# EAGLE design AugmentedStethoscope_v2c (EAGLE 8.7.0)
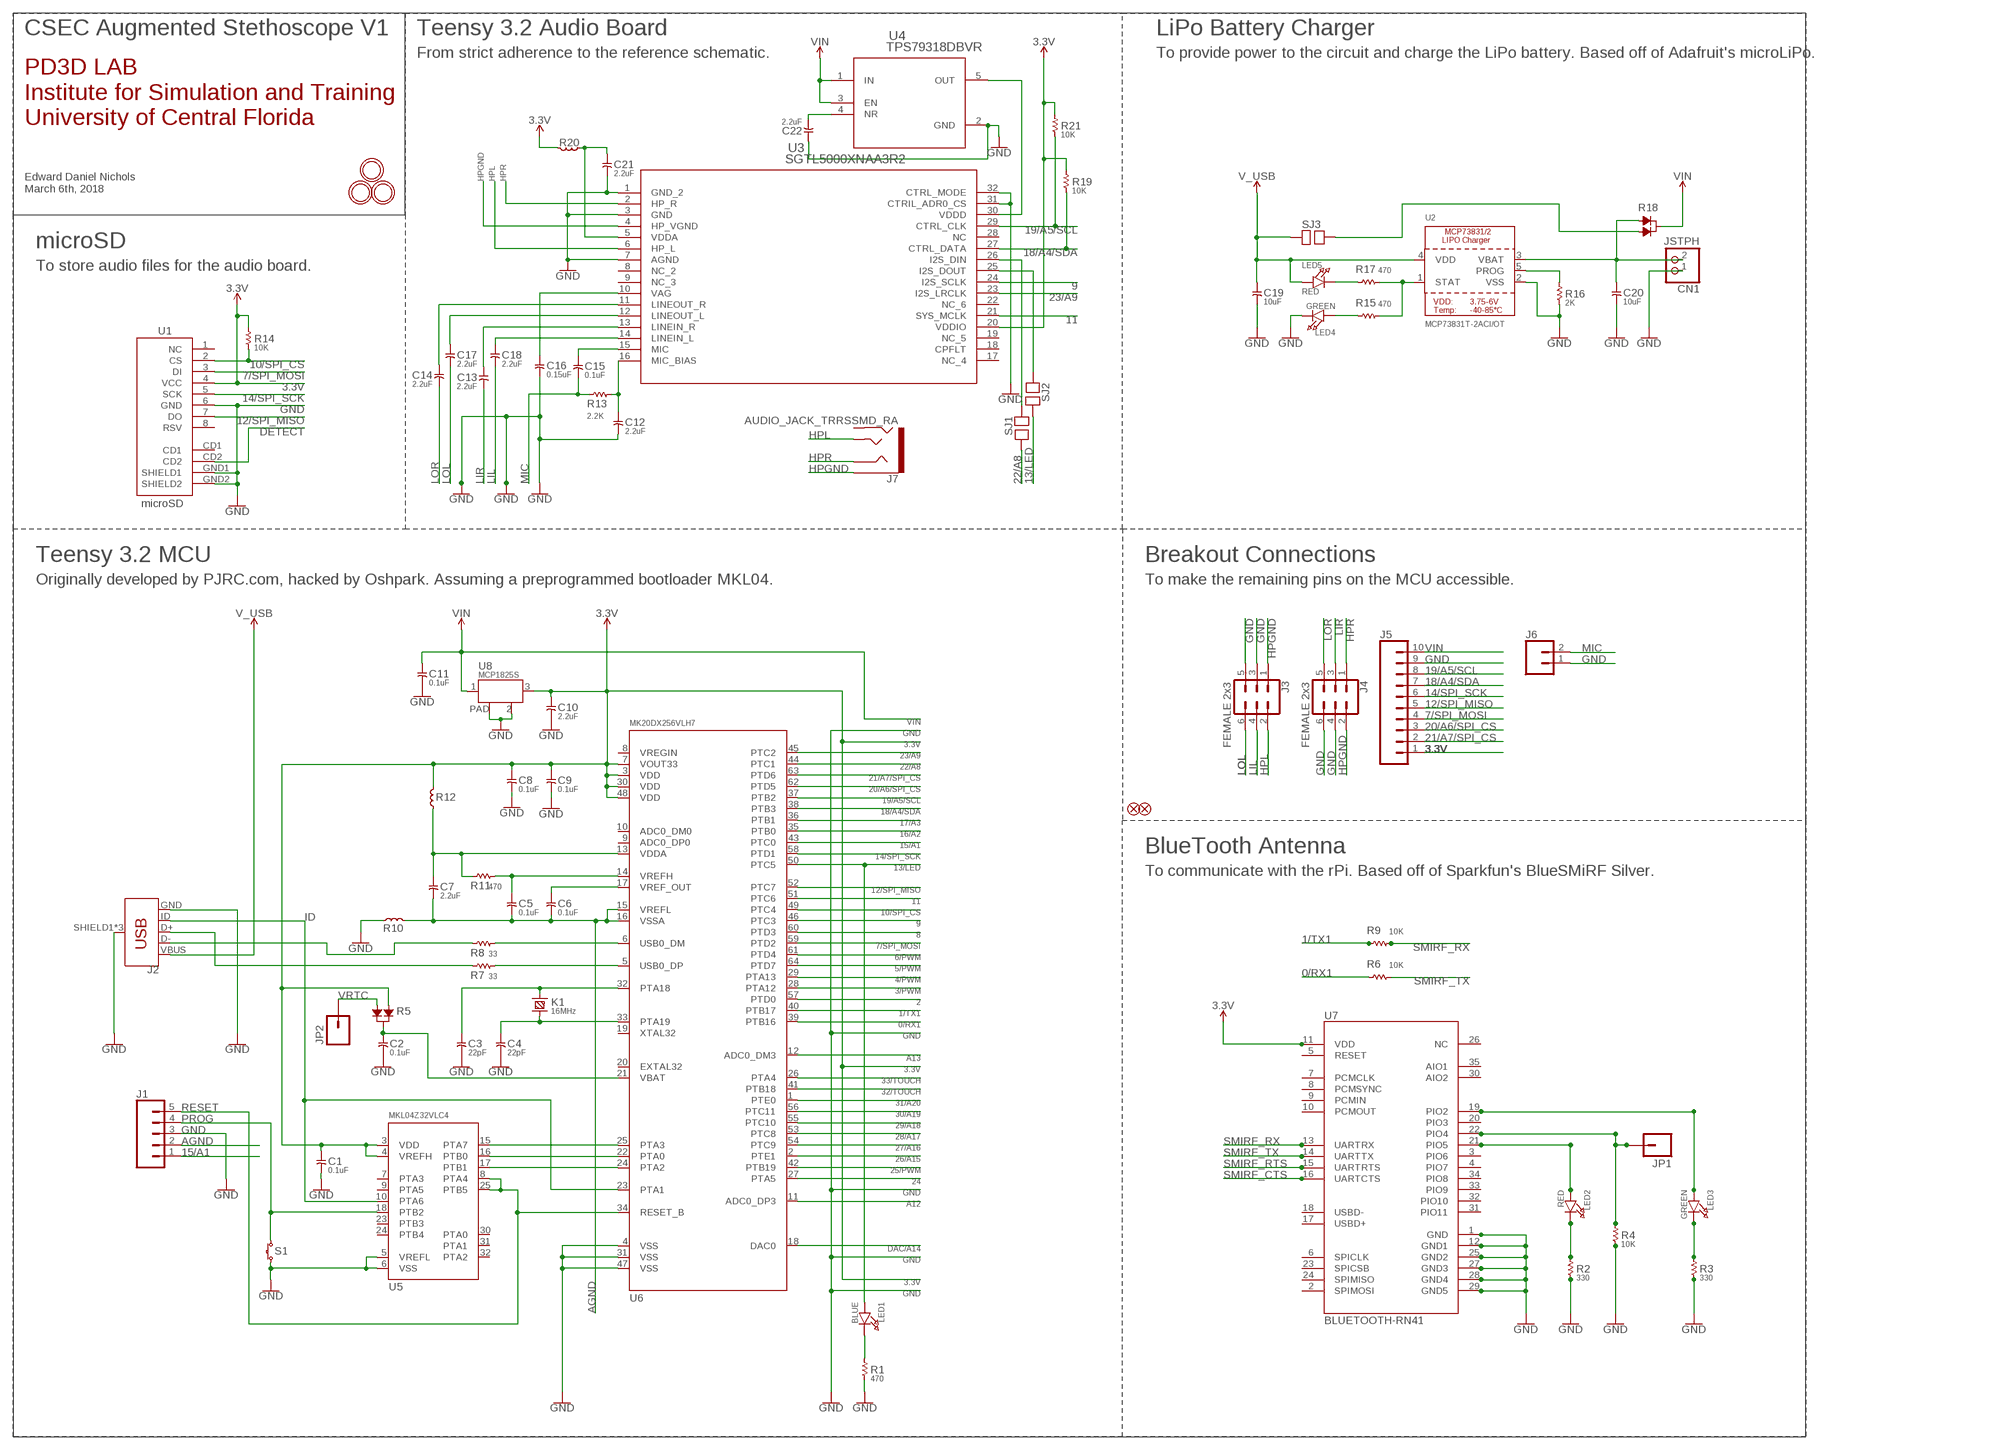
[diagram p0: schematic, sheet 1]

## Parts
C1  0.1uF  CAPACITOR-0.1UF  [C0603]
C2  0.1uF  CAPACITOR-0.1UF  [C0603]
C3  22pF  CAPACITOR-22PF  [C0603]
C4  22pF  CAPACITOR-22PF  [C0603]
C5  0.1uF  CAPACITOR-0.1UF  [C0603]
C6  0.1uF  CAPACITOR-0.1UF  [C0603]
C7  2.2uF  CAPACITOR-2.2UF  [C0805]
C8  0.1uF  CAPACITOR-0.1UF  [C0603]
C9  0.1uF  CAPACITOR-0.1UF  [C0603]
C10  2.2uF  CAPACITOR-2.2UF  [C0805]
C11  0.1uF  CAPACITOR-0.1UF  [C0603]
C12  2.2uF  CAPACITOR-2.2UF  [C0805]
C13  2.2uF  CAPACITOR-2.2UF  [C0805]
C14  2.2uF  CAPACITOR-2.2UF  [C0805]
C15  0.1uF  CAPACITOR-2.2UF  [C0805]
C16  0.15uF  CAPACITOR-0.1UF  [C0603]
C17  2.2uF  CAPACITOR-2.2UF  [C0805]
C18  2.2uF  CAPACITOR-2.2UF  [C0805]
C19  10uF  CAPACITOR-0.1UF  [C0603]
C20  10uF  CAPACITOR-0.1UF  [C0603]
C21  2.2uF  CAPACITOR-2.2UF  [C0805]
C22  2.2uF  CAPACITOR-2.2UF  [C0805]
CN1  JSTPH  JST_2PIN  [JSTPH2]
FID2  FIDUCIAL""  [FIDUCIAL_1MM]
FID3  FIDUCIAL""  [FIDUCIAL_1MM]
J1  CONN_05  [1X05]
J2  USB_MICRO-B_FEMALE-SMT  [USB-B-MICRO-SMD]
J3  FEMALE 2x3  CONN_03X2FEMALE  [2X3]
J4  FEMALE 2x3  CONN_03X2FEMALE  [2X3]
J5  CONN_10"  [1X10]
J6  CONN_02  [1X02]
J7  AUDIO_JACK_TRRSSMD_RA  [AUDIO_JACK_3.5MM_TRRS_SMD_RA]
JP1  M01SMDNS  [1X01NS]
JP2  M01SMDNS  [1X01NS]
K1  16MHz  CRYSTAL-HC49US  [HC49US]
LED1  BLUE  LED0805  [CHIPLED_0805]
LED2  RED  LED0805  [CHIPLED_0805]
LED3  GREEN  LED0805  [CHIPLED_0805]
LED4  GREEN  LED0805  [CHIPLED_0805]
LED5  RED  LED0805  [CHIPLED_0805]
R1  470  RESISTOR-470R  [R0603]
R2  330  RESISTOR-470R  [R0603]
R3  330  RESISTOR-470R  [R0603]
R4  10K  RESISTOR-470R  [R0603]
R5  DIODE_DUAL  [SOT-23]
R6  10K  RESISTOR-33R  [R0603]
R7  33  RESISTOR-33R  [R0603]
R8  33  RESISTOR-33R  [R0603]
R9  10K  RESISTOR-33R  [R0603]
R10  FERRITE  [L0603]
R11  470  RESISTOR-470R  [R0603]
R12  FERRITE  [L0603]
R13  2.2K  RESISTOR-470R  [R0603]
R14  10K  RESISTOR-470R  [R0603]
R15  470  RESISTOR-33R  [R0603]
R16  2K  RESISTOR-470R  [R0603]
R17  470  RESISTOR-33R  [R0603]
R18  DIODE_DUAL  [SOT-23]
R19  10K  RESISTOR-470R  [R0603]
R20  FERRITE  [L0603]
R21  10K  RESISTOR-470R  [R0603]
S1  TACT_SWITCH  [ALPS_SKHH]
SJ1  SOLDERJUMPER  [SOLDERJUMPER]
SJ2  SOLDERJUMPER  [SOLDERJUMPER]
SJ3  SOLDERJUMPER  [SOLDERJUMPER]
U1  microSD  USD-SOCKETSMD  [MICRO-SD-SOCKET-PP]
U2  MCP73831T-2ACI/OT  MCP73831/2  [SOT23-5]
U3  SGTL5000XNAA3R2  [QFN32]
U4  TPS79318DBVR  [DBV5]
U5  MKL04Z32VLC4  [LQFP32-08]
U6  MK20DX256VLH7  [LQFP64-05]
U7  BLUETOOTH-RN41  BLUETOOTH-RN41"  [RN41]
U8  MCP1825S  LDO  [SOT-223]
U$1  MOUNTINGHOLE2.5  [MOUNTINGHOLE_2.5_PLATED]
U$3  MOUNTINGHOLE2.5  [MOUNTINGHOLE_2.5_PLATED]
U$15  MOUNTINGHOLE2.5  [MOUNTINGHOLE_2.5_PLATED]

## Nets
0/RX1: R6.1 U6.39(PTB16)
1/TX1: R9.1 U6.40(PTB17)
2: U6.57(PTD0)
3.3V [power]: C1.1 C8.1 C9.1 C10.1 J5.1 R5.1 R12.2 R14.2 R19.2 R20.2 R21.2 U1.4(VCC) U3.20(VDDIO) U5.3(VDD) U5.4(VREFH) U6.3(VDD) U6.7(VOUT33) U6.30(VDD) U6.48(VDD) U7.11(VDD) U8.3(OUT)
3/PWM: U6.28(PTA12)
4/PWM: U6.29(PTA13)
5/PWM: U6.64(PTD7)
6/PWM: U6.61(PTD4)
7/SPI_MOSI: J5.4 U1.3(DI) U6.59(PTD2)
8: U6.60(PTD3)
9: U3.24(I2S_SCLK) U6.46(PTC3)
10/SPI_CS: R14.1 U1.2(CS) U6.49(PTC4)
11: U3.21(SYS_MCLK) U6.51(PTC6)
12/SPI_MISO: J5.5 U1.7(DO) U6.52(PTC7)
13/LED: LED1.A SJ2.2 U6.50(PTC5)
14/SPI_SCK: J5.6 U1.5(SCK) U6.58(PTD1)
15/A1: J1.1 U6.43(PTC0)
16/A2: U6.35(PTB0)
17/A3: U6.36(PTB1)
18/A4/SDA: J5.7 R19.1 U3.27(CTRL_DATA) U6.38(PTB3)
19/A5/SCL: J5.8 R21.1 U3.29(CTRL_CLK) U6.37(PTB2)
20/A6/SPI_CS: J5.3 U6.62(PTD5)
21/A7/SPI_CS: J5.2 U6.63(PTD6)
22/A8: SJ1.2 U6.44(PTC1)
23/A9: U3.23(I2S_LRCLK) U6.45(PTC2)
24: U6.27(PTA5)
25/PWM: U6.42(PTB19)
26/A15: U6.2(PTE1)
27/A16: U6.54(PTC9)
28/A17: U6.53(PTC8)
29/A18: U6.55(PTC10)
30/A19: U6.56(PTC11)
31/A20: U6.1(PTE0)
32/TOUCH: U6.41(PTB18)
33/TOUCH: U6.26(PTA4)
A12: U6.11(ADC0_DP3)
A13: U6.12(ADC0_DM3)
AGND: C5.2 C6.2 C7.2 J1.2 R10.2 U6.15(VREFL) U6.16(VSSA)
D3: LED2.C R2.2
D4: LED3.C R3.2
D+: J2.D+ R7.1
D-: J2.D- R8.1
DAC/A14: U6.18(DAC0)
DETECT: U1.CD2
GND [power]: C1.2 C2.2 C3.2 C4.2 C8.2 C9.2 C10.2 C11.2 C12.2 C16.2 C19.2 C20.2 C21.2 C22.1 CN1.1 J1.3 J2.GND J2.SHIELD1(SHIELD) J2.SHIELD2(SHIELD) J2.SHIELD3(SHIELD) J3.3 J3.5 J4.4 J4.6 J5.9 J6.1 LED4.C R1.1 R2.1 R3.1 R4.1 R10.1 R16.1 S1.3 S1.4 U1.6(GND) U1.GND1(SHIELD1) U1.GND2(SHIELD2) U2.2(VSS) U3.1(GND_2) U3.3(GND) U3.7(AGND) U3.31(CTRIL_ADR0_CS) U3.32(CTRL_MODE) U4.2(GND) U5.5(VREFL) U5.6(VSS) U6.4(VSS) U6.31(VSS) U6.47(VSS) U7.1(GND) U7.12(GND1) U7.25(GND2) U7.27(GND3) U7.28(GND4) U7.29(GND5) U8.2(GND) U8.PAD
HPGND: J3.1 J4.2 J7.EARTH U3.4(HP_VGND)
HPL: J3.2 J7.TIP U3.6(HP_L)
HPR: J4.1 J7.RING1 U3.2(HP_R)
ID: J2.ID U5.10(PTA6) U6.23(PTA1)
LIL: C18.2 J3.4
LIL_ISO: C18.1 U3.14(LINEIN_L)
LIR: C13.2 J4.3
LIR_ISO: C13.1 U3.13(LINEIN_R)
LOL: C17.2 J3.6
LOL_ISO: C17.1 U3.12(LINEOUT_L)
LOR: C14.2 J4.5
LOR_ISO: C14.1 U3.11(LINEOUT_R)
MIC: C15.2 J6.2 R13.1
MIC_BIAS: C12.1 R13.2 U3.16(MIC_BIAS)
N$1: C20.1 CN1.2 R18.1 U2.3(VBAT)
N$2: U5.16(PTB0) U6.22(PTA0)
N$3: U5.17(PTB1) U6.24(PTA2)
N$4: C16.1 U3.10(VAG)
N$5: C3.1 K1.1 U6.32(PTA18)
N$6: C4.1 K1.2 U6.33(PTA19)
N$7: C5.1 R11.2 U6.14(VREFH)
N$8: C22.2 U4.4(NR)
N$9: SJ1.1 U3.26(I2S_DIN)
N$10: R7.2 U6.5(USB0_DP)
N$11: C6.1 U6.17(VREF_OUT)
N$12: U3.30(VDDD) U4.5(OUT)
N$13: SJ2.1 U3.25(I2S_DOUT)
N$14: R8.2 U6.6(USB0_DM)
N$15: C7.1 R11.1 R12.1 U6.13(VDDA)
N$18: R18.2 SJ3.2
N$52: LED1.C R1.2
N$68: C2.1 R5.3 U6.21(VBAT)
N$70: U5.15(PTA7) U6.25(PTA3)
N$71: LED5.C R17.1
N$72: R15.2 R17.2 U2.1(STAT)
N$73: LED2.A U7.21(PIO5)
N$74: LED3.A U7.19(PIO2)
N$75: R16.2 U2.5(PROG)
N$76: LED4.A R15.1
N$79: C21.1 R20.1 U3.5(VDDA)
N$80: C15.1 U3.15(MIC)
PIO4: JP1.1 R4.2 U7.22(PIO4)
PROG: J1.4 S1.1 S1.2 U5.18(PTB2)
RESET: J1.5 U5.8(PTA4) U5.25(PTB5) U6.34(RESET_B)
SMIRF_CTS: U7.16(UARTCTS)
SMIRF_RTS: U7.15(UARTRTS)
SMIRF_RX: R9.2 U7.13(UARTRX)
SMIRF_TX: R6.2 U7.14(UARTTX)
V_USB [power]: C19.1 J2.VBUS LED5.A SJ3.1 U2.4(VDD)
VIN [power]: C11.1 J5.10 R18.3 U4.1(IN) U4.3(EN) U8.1(IN)
VRTC: JP2.1 R5.2
Unconnected: J7.RING2 U1.1(NC) U1.8(RSV) U1.CD1 U3.8(NC_2) U3.9(NC_3) U3.17(NC_4) U3.18(CPFLT) U3.19(NC_5) U3.22(NC_6) U3.28(NC) U5.7(PTA3) U5.9(PTA5) U5.23(PTB3) U5.24(PTB4) U5.30(PTA0) U5.31(PTA1) U5.32(PTA2) U6.8(VREGIN) U6.9(ADC0_DP0) U6.10(ADC0_DM0) U6.19(XTAL32) U6.20(EXTAL32) U7.2(SPIMOSI) U7.3(PIO6) U7.4(PIO7) U7.5(RESET) U7.6(SPICLK) U7.7(PCMCLK) U7.8(PCMSYNC) U7.9(PCMIN) U7.10(PCMOUT) U7.17(USBD+) U7.18(USBD-) U7.20(PIO3) U7.23(SPICSB) U7.24(SPIMISO) U7.26(NC) U7.30(AIO2) U7.31(PIO11) U7.32(PIO10) U7.33(PIO9) U7.34(PIO8) U7.35(AIO1)

## Notes on the sheet
- CSEC Augmented Stethoscope V1 | Teensy 3.2 Audio Board | LiPo Battery Charger
- From strict adherence to the reference schematic. | To provide power to the circuit and charge the LiPo battery. Based off of Adafruit's microLiPo.
- PD3D LAB
  Institute for Simulation and Training
  University of Central Florida
- Edward Daniel Nichols
  March 6th, 2018
- microSD
- To store audio files for the audio board.
- Teensy 3.2 MCU | Breakout Connections
- Originally developed by PJRC.com, hacked by Oshpark. Assuming a preprogrammed bootloader MKL04. | To make the remaining pins on the MCU accessible.
- BlueTooth Antenna
- To communicate with the rPi. Based off of Sparkfun's BlueSMiRF Silver.

## Library data of the parts
C1 C2 C5 C6 C8 C9 C11 = t32_ref:CAPACITOR-0.1UF; DESC: 0.1uF / 16VDC / X7R; MF: Murata Electronics; MPN: GRM188R71C104KA01D; OC_MOUSER: 81-GRM39X104K16; PACKAGE: 0603; TYPE: Capacitor
C3 C4 = t32_ref:CAPACITOR-22PF; DESC: 22pF / 50VDC / C0G (NP0); MF: Vishay / Vitramon; MPN: VJ0603A220JXACW1BC; OC_MOUSER: 77-VJ0603A220JXACBC; PACKAGE: 0603; TYPE: Capacitor
C7 C10 C12-C14 C17 C18 C21 C22 = t32_ref:CAPACITOR-2.2UF; DESC: 2.2uF / 25 VDC / X7R; MF: Taiyo Yuden; MPN: TMK212B7225KG-TR; OC_MOUSER: 963-TMK212B7225KG-TR; PACKAGE: 0805; TYPE: Capacitor
C15 = t32_ref:CAPACITOR-2.2UF; DESC: 2.2uF / 25 VDC / X7R; MF: Taiyo Yuden; MPN: TMK212B7225KG-TR; OC_MOUSER: 963-TMK212B7225KG-TR; PACKAGE: 0805; TYPE: Capacitor; VALUE: 2.2uF
C16 C19 C20 = t32_ref:CAPACITOR-0.1UF; DESC: 0.1uF / 16VDC / X7R; MF: Murata Electronics; MPN: GRM188R71C104KA01D; OC_MOUSER: 81-GRM39X104K16; PACKAGE: 0603; TYPE: Capacitor; VALUE: 0.1uF
CN1 = microbuilder:JST_2PIN: JST 2-Pin Right-Angle Connector PH-Series - 4UConnector: 17311 SH-Series - 4UConnector: 07278
FID2 FID3 = microbuilder:FIDUCIAL: Fiducial Alignment Points Various fiducial points for machine vision alignment.; BOM: EXCLUDE
J1 = SparkFun-Connectors:CONN_05: Multi connection point. Often used as Generic Header-pin footprint for 0.1 inch spaced/style header connections On any of the 0.1 inch spaced packages, you can populate with these: Break Away Headers - Straight <https://www.sparkfun.com/products/116> (PRT-00116) Break Away Male Headers - Right Angle <https://www.sparkfun.com/products/553> (PRT-00553) Female Headers <https://www.sparkfun.com/products/115> (PRT-00115) Break Away Headers - Machine Pin <https://www.sparkfun.com/products/117> (PRT-00117) Break Away Female Headers - Swiss Machine Pin <https://www.sparkfun.com/products/743> (PRT-00743) For SCREWTERMINALS and SPRING TERMINALS visit here: Screw Terimnals on SparkFun.com <https://www.sparkfun.com/search/results?term=Screw+Terminals> (5mm/3.5mm/2.54mm spacing) This device is also useful as a general connection point to wire up your design to another part of your project. Our various solder wires solder well into these plated through hole pads. Hook-Up Wire - Assortment (Stranded, 22 AWG) <https://www.sparkfun.com/products/11375> (PRT-11375) Hook-Up Wire - Assortment (Solid Core, 22 AWG) <https://www.sparkfun.com/products/11367> (PRT-11367) View the entire wire category on our website here <https://www.sparkfun.com/categories/141> Special notes: Molex polarized connector foot print use with SKU : PRT-08231 with associated crimp pins and housings. 1MM SMD Version SKU: PRT-10208
J2 = SparkFun-Connectors:USB_MICRO-B: USB Type Micro-B Connector Male/female and PTH/SMT variants SparkFun Products: SparkFun microB USB Breakout <https://www.sparkfun.com/products/12035> SparkFun USB microB Plug Breakout <https://www.sparkfun.com/products/10031> SparkFun ESP8266 Thing <https://www.sparkfun.com/products/13231>; PROD_ID: CONN-11752
J3 J4 = SparkFun-Connectors:CONN_03X2: Multi connection point. Often used as Generic Header-pin footprint for 0.1 inch spaced/style header connections You can populate with any combo of single row headers, but if you'd like an exact match, check these: Header - 2x3 (Male, 0.1") <https://www.sparkfun.com/products/12807> (PRT-12807) Header - 2x3 (Female, 0.1") <https://www.sparkfun.com/products/13010> (PRT-13010) 2x3 Pin Shrouded Header <https://www.sparkfun.com/products/10877> (PRT-10877) On any of the 0.1 inch spaced packages, you can populate with these: Break Away Headers - Straight <https://www.sparkfun.com/products/116> (PRT-00116) Break Away Male Headers - Right Angle <https://www.sparkfun.com/products/553> (PRT-00553) Female Headers <https://www.sparkfun.com/products/115> (PRT-00115) Break Away Headers - Machine Pin <https://www.sparkfun.com/products/117> (PRT-00117) Break Away Female Headers - Swiss Machine Pin <https://www.sparkfun.com/products/743> (PRT-00743) Special note: the shrouded connector mates well with our 3x2 ribbon cables: Ribbon Crimp Connector - 6-pin (2x3, Female) <https://www.sparkfun.com/products/10651> (PRT-10651) Ribbon Cable - 6 wire (15ft) <https://www.sparkfun.com/products/10646> (PRT-10646); PROD_ID: CONN-11566
J5 = SparkFun-Connectors:CONN_10: Multi connection point. Often used as Generic Header-pin footprint for 0.1 inch spaced/style header connections On any of the 0.1 inch spaced packages, you can populate with these: Break Away Headers - Straight <https://www.sparkfun.com/products/116> (PRT-00116) Break Away Male Headers - Right Angle <https://www.sparkfun.com/products/553> (PRT-00553) Female Headers <https://www.sparkfun.com/products/115> (PRT-00115) Break Away Headers - Machine Pin <https://www.sparkfun.com/products/117> (PRT-00117) Break Away Female Headers - Swiss Machine Pin <https://www.sparkfun.com/products/743> (PRT-00743) Arduino Stackable Header - 10 Pin <https://www.sparkfun.com/products/11376> (PRT-11376) For SCREWTERMINALS and SPRING TERMINALS visit here: Screw Terimnals on SparkFun.com <https://www.sparkfun.com/search/results?term=Screw+Terminals> (5mm/3.5mm/2.54mm spacing) This device is also useful as a general connection point to wire up your design to another part of your project. Our various solder wires solder well into these plated through hole pads. Hook-Up Wire - Assortment (Stranded, 22 AWG) <https://www.sparkfun.com/products/11375> (PRT-11375) Hook-Up Wire - Assortment (Solid Core, 22 AWG) <https://www.sparkfun.com/products/11367> (PRT-11367) View the entire wire category on our website here <https://www.sparkfun.com/categories/141> Special notes: Molex polarized connector foot print use with SKU : PRT-08231 with associated crimp pins and housings. 1MM SMD Version SKU: PRT-10208 NOTES ON THE VARIANTS LOCK and LOCK_LONGPADS... This footprint was designed to help hold the alignment of a through-hole component (i.e. 6-pin header) while soldering it into place. You may notice that each hole has been shifted either up or down by 0.005 of an inch from it's more standard position (which is a perfectly straight line). This slight alteration caused the pins (the squares in the middle) to touch the edges of the holes. Because they are alternating, it causes a "brace" to hold the component in place. 0.005 has proven to be the perfect amount of "off-center" position when using our standard breakaway headers. Although looks a little odd when you look at the bare footprint, once you have a header in there, the alteration is very hard to notice. Also,if you push a header all the way into place, it is covered up entirely on the bottom side.; PROD_ID: CONN-11563
J6 = SparkFun-Connectors:CONN_02: Multi connection point. Often used as Generic Header-pin footprint for 0.1 inch spaced/style header connections On any of the 0.1 inch spaced packages, you can populate with these: Break Away Headers - Straight <https://www.sparkfun.com/products/116> (PRT-00116) Break Away Male Headers - Right Angle <https://www.sparkfun.com/products/553> (PRT-00553) Female Headers <https://www.sparkfun.com/products/115> (PRT-00115) Break Away Headers - Machine Pin <https://www.sparkfun.com/products/117> (PRT-00117) Break Away Female Headers - Swiss Machine Pin <https://www.sparkfun.com/products/743> (PRT-00743) For SCREWTERMINALS and SPRING TERMINALS visit here: Screw Terimnals on SparkFun.com <https://www.sparkfun.com/search/results?term=Screw+Terminals> (5mm/3.5mm/2.54mm spacing) This device is also useful as a general connection point to wire up your design to another part of your project. Our various solder wires solder well into these plated through hole pads. Hook-Up Wire - Assortment (Stranded, 22 AWG) <https://www.sparkfun.com/products/11375> (PRT-11375) Hook-Up Wire - Assortment (Solid Core, 22 AWG) <https://www.sparkfun.com/products/11367> (PRT-11367) View the entire wire category on our website here <https://www.sparkfun.com/categories/141> Special notes: Molex polarized connector foot print use with: PRT-08233 with associated crimp pins and housings. 2.54_SCREWTERM for use with PRT-10571. 3.5mm Screw Terminal footprints for PRT-08084 5mm Screw Terminal footprints for use with PRT-08432
J7 = SparkFun-Connectors:AUDIO_JACK_TRRS: Audio Jack - 3.5mm TRRS (SMD) This is a 3.5mm TRRS SMD audio jack. TRRS connectors are the audio-style connectors that you see on some phones, MP3 players and development boards. TRRS stands for “tip, ring, ring, sleeve,” which reflects that this has three conductors and a ground. SparkFun Products: Audio Jack <https://www.sparkfun.com/products/12639> mbed Starter Kit <https://www.sparkfun.com/products/12968> SparkFun TRRS 3.5mm Jack Breakout <https://www.sparkfun.com/products/11570>; PROD_ID: CONN-10676; SF_ID: PRT-12639
JP1 JP2 = SparkFun:M01: Header 1 Standard 1-pin 0.1" header. Use with straight break away headers (SKU : PRT-00116), right angle break away headers (PRT-00553), swiss pins (PRT-00743), machine pins (PRT-00117), and female headers (PRT-00115).
K1 = t32_ref:CRYSTAL-; DESC: 16MHz / 18pF / 10ppm; MF: ABRACON; MPN: ABL-16.000MHz-B1U; OC_MOUSER: 815-ABL-16-B1U; PACKAGE: HC-49US; TYPE: Crystal
LED1-LED5 = microbuilder:LED: LED 0603 - 0603 Surface Mount Package 2mA: Green LED - Low Power (3.9mcd, 2ma, 1.7Vf) - Digikey: 475-2709-2-ND Orange LED - Low Power (9.8mcd, 2ma, 1.8Vf) - Digikey: 475-1194-2-ND Red LED - Low Power (5mcd, 2ma, 1.8Vf) - Digikey: 475-1195-2-ND Yellow LED - Low Power (7mcd, 2ma, 1.8Vf) - Digikey: 475-1196-2-ND 5mA: Blue LED - Low Power (17mcd, 5ma, 2.9Vf) - Digikey: LNJ937W8CRACT-ND 0805 - 0805 Surface Mount Package 2mA: Red LED (8.8mcd, 2mA, 1.8Vf, Clear) - Low Power [Digikey: 475-2510-1-ND] Green LED (5mcd, 2mA, 1.8Vf, Clear) - Low Power [Digikey: 475-2730-1-ND] Yellow LED (11.3mcd, 2mA, 1.8Vf, Clear) - Low Power [Digikey: 475-2555-1-ND] 20mA: Red LED (104mcd, 20mA, Diffused) - LS R976 [Digikey: 475-1278-6-ND] Red LED (12mcd, 20mA, 2.0Vf, Clear) - APT2012EC [Digikey: 754-1128-1-ND] Green LED (15mcd, 20mA, 2.2Vf, Clear) - APT2012GC [Digikey: 754-1131-1-ND] Orange LED (160mcd, 20mA, 2.1Vf, Clear) - APT2012SECK [Digikey: 754-1130-1-ND] 1206 - 1206 Surface Mount Package Green LED (26mcd, 20mA, Diffused) - LG N971 [Digikey: 475-1407-6-ND] Red LED (15mcd, 20mA, Diffused) - LH N974 [Digikey: 475-1416-6-ND] Cree - Cree High-Power Surface Mount LEDs XPEBWT-L1-0000-00D50 - White 111lm 350mA 2.9Vf 6200K 110° XTEAWT-00-0000-00000LEE3 - White 114lm 350mA 2.85Vf 5000K 115°
R1-R4 R11 R13 R14 R16 R19 R21 = t32_ref:RESISTOR-470R; DESC: 470R / 1 % / 0.1 W; MF: Vishay; MPN: CRCW0603470RFKEA; OC_MOUSER: 71-CRCW0603-470-E3; PACKAGE: 0603; TYPE: Resistor; VALUE: 470R
R5 R18 = t32_ref:DIODE_DUAL; DESC: Dual Schottky, common cat; MF: NXP Semiconductors; MPN: BAT54C,215; OC_MOUSER: 771-BAT54C-T/R; PACKAGE: SOT-23; TYPE: Diode
R6-R9 R15 R17 = t32_ref:RESISTOR-33R; DESC: 33R / 1% / 0.25 W; MF: Panasonic; MPN: ERJ-PA3F33R0V; OC_MOUSER: 667-ERJ-PA3F33R0V; PACKAGE: 0603; TYPE: Resistor; VALUE: 33R
R10 R12 R20 = t32_ref:FERRITE; DESC: 600R / 100MHz; MF: Murata Electronics; MPN: BLM18AG601SN1D; OC_MOUSER: 81-BLM11A601S; PACKAGE: 0603; TYPE: Ferrite
S1 = t32_ref:TACT_SWITCH; DESC: SPST; MF: ALPS; MPN: SKHHPKA010; OC_MOUSER: 688-SKHHPK; PACKAGE: 6x6x5 MM; TYPE: Tactile switch
SJ1-SJ3 = t32_ref:SOLDERJUMPER
U1 = SparkFun:USD-SOCKET: microSD Socket Push-push type uSD socket. Schematic element and footprint production proven. Spark Fun Electronics SKU : PRT-00127. tDoc lines correctly indicate media card edge positions when inserting (unlocked, locked, depressed).
U2 = microbuilder:MCP73831/2: MCP73831/2 LIPO Charger VDD: 3.75 - 6V Temp -40 - 85°C Programmable Charge Rate: 15-500mA NOTE: STAT is a tri-state logic output on the MCP73831 and an open-drain output on the MCP73832. SOT23-5 with 4.2V output and tri-state logic on STAT = MCP73831T-2ACI/OT
U3 = pd3d_augmentedstethoscope:SGTL5000XNAA3R2: SGTL5000XNAA3R2TR-ND Low Power Stereo Codec with Headphone Amp used on the Teensy 3.1+ Audio Board Datasheet: https://www.nxp.com/docs/en/data-sheet/SGTL5000.pdf (valid as of Feb. 2018) Exported from digikey.ultralibrarian.com under part ID: SGTL5000XNAA3R2TR-ND EDN; MANUFACTURER_PART_NUMBER: SGTL5000XNAA3R2; VENDOR: Freescale
U4 = pd3d_augmentedstethoscope:TPS79318DBVR: TPS79318DBVR Low-Noise, High PSRR, RF, 200-mA Low-Dropout Linear Regulators in NanoStar™ Wafer Chip Scale and SOT-23; MANUFACTURER_PART_NUMBER: TPS79318DBVR; VENDOR: Texas Instruments
U5 = t32_ref:MKL04Z32VLC4; DESC: MKL04Z32VLC4 (preprogrammed); MF: PJRC; MPN: IC_MKL04Z32_TQFP32; PACKAGE: LQFP-32; TYPE: Microcontroller
U6 = t32_ref:MK20DX256VLH7; DESC: MK20DX256VLH7; MF: NXP; MPN: MK20DX256VLH7; OC_MOUSER: 841-MK20DX256VLH7; PACKAGE: LQFP-64; TYPE: Microcontroller
U7 = ScratchPad:BLUETOOTH-RN41
U8 = t32_ref:LDO; DESC: 3.3V 500mA; MF: Microchip Technology; MPN: MCP1825S-3302E/DB; OC_MOUSER: 579-MCP1825S-3302EDB; PACKAGE: SOT-223-3; TYPE: Voltage regulator
U$1 U$3 U$15 = microbuilder:MOUNTINGHOLE: Mounting Hole For #2 screws (0.086"/2.18mm width, 0.094"/2.4mm hole) use 2.5mm; BOM: EXCLUDE

## Net classes
0 default: width 0.254 mm, drill 0.203 mm, clearance 0.152 mm
1 power: width 0.406 mm, drill 0.203 mm, clearance 0.203 mm

## Board
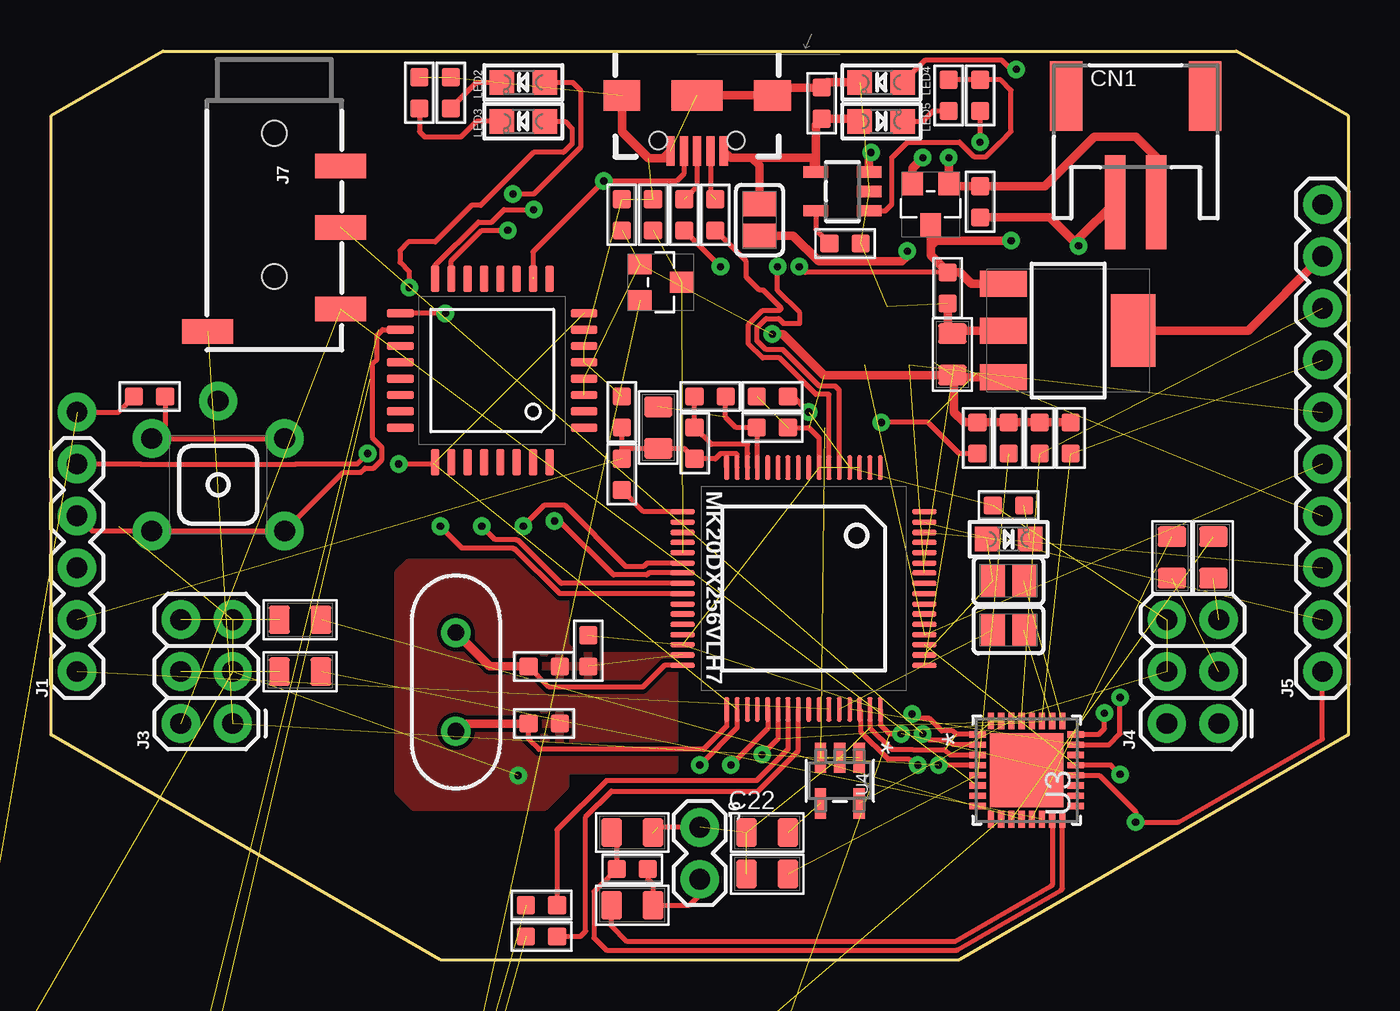
[diagram p1: board, top side]
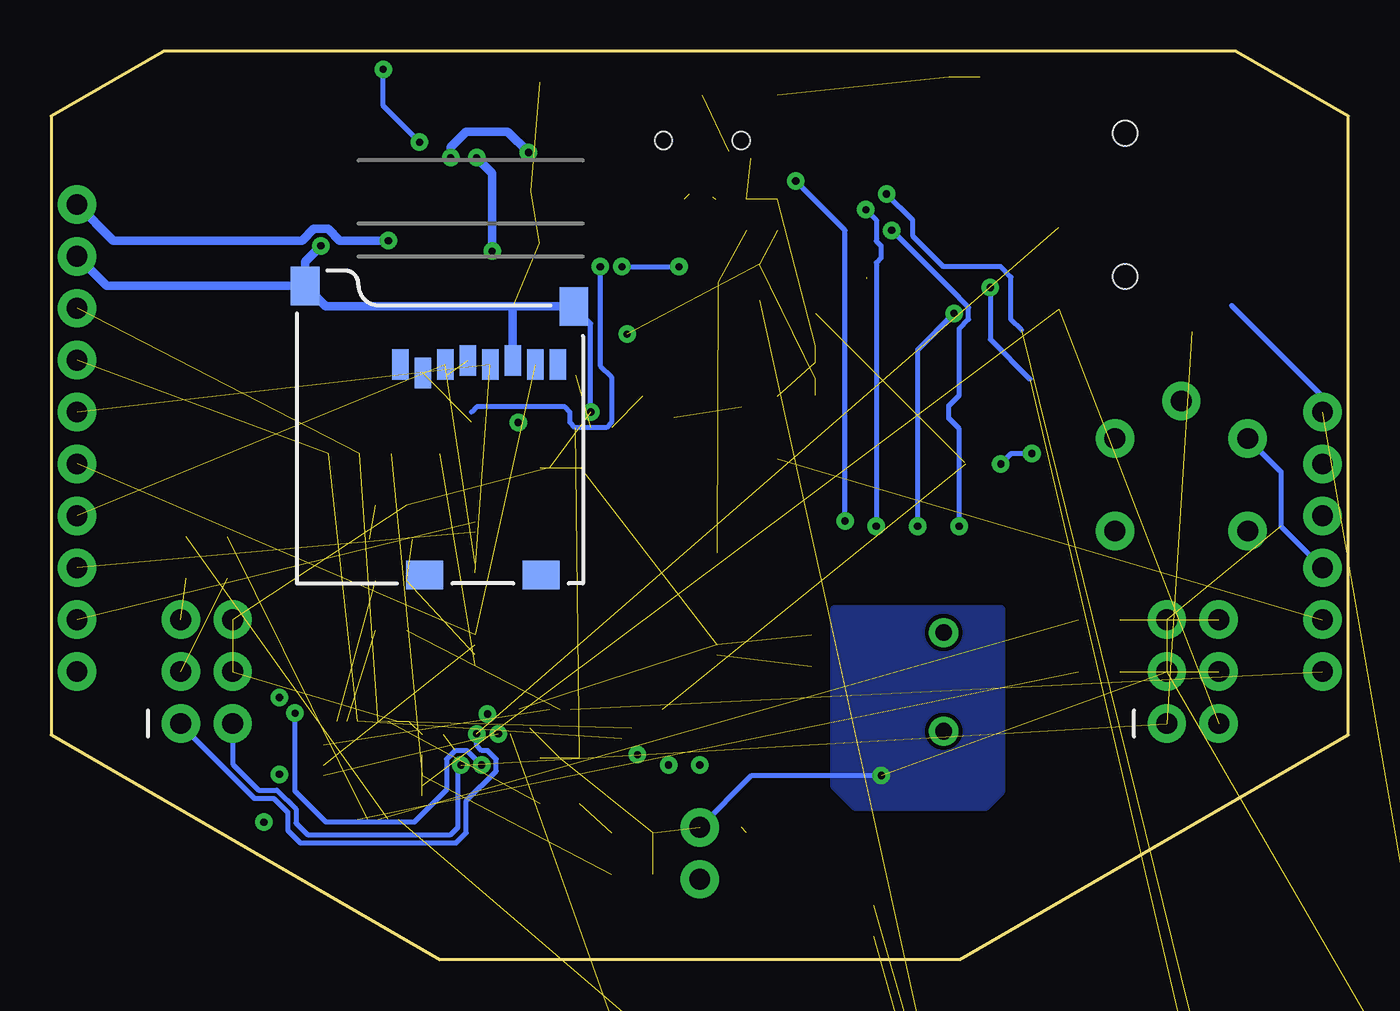
[diagram p2: board, bottom side, seen from below]

Size 63.5 x 44.45 mm. Coordinates in mm from the lower left corner, seen from the top.
Outline: 5.5,44.45 58,44.45 63.5,41.28 63.5,11 44.45,0 19.05,0 0,11 0,41.28 5.5,44.45
Copper layers (1*16): Top 0.035mm / dielectric 1.5mm / Bottom 0.035mm
Design rules "SparkFun *": minimum track width 8mil, minimum drill 10mil, track to track 6mil, track to pad 6mil, pad to pad 6mil, via to via 6mil, smd to smd 4mil, copper to edge 10mil, drill to drill 8mil, minimum pad ring 12mil, minimum via ring 10mil, stop-mask expansion 4mil, vias tented up to drill 25mil, thermal gap 8mil

### Footprints (pad centres in the part's own frame; a part is rotated, then mirrored left to right if it is on the bottom)
C0603 = smd 0.889 x 0.889: 1 0,0.762; 2 0,-0.762
C0805 = smd 1.397 x 1.016: 1 0,1.016; 2 0,-1.016
JSTPH2 = smd 1 x 4.6: 1 -1,-3.7; 2 1,-3.7 | smd 1.6 x 3.4: NC1 -3.4,1.5; NC2 3.4,1.5
FIDUCIAL_1MM = smd 1 x 1: 1 0,0
1X05 = drill 1.016 pad 1.88: 1 0,0; 2 2.54,0; 3 5.08,0; 4 7.62,0; 5 10.16,0
USB-B-MICRO-SMD = smd 1.45 x 0.4: D+ 2.725,0; D- 2.725,0.65; GND 2.725,-1.3; ID 2.725,-0.65; VBUS 2.725,1.3 | smd 1.5 x 1.8: SHIELD1 0,3.685; SHIELD2 0,-3.685 | smd 1.5 x 2.5: SHIELD3 0,0 | hole 0.85: 2.2,1.9; 2.2,-1.9
2X3 = drill 1.016 pad 1.88: 1 0,0; 2 0,2.54; 3 2.54,0; 4 2.54,2.54; 5 5.08,0; 6 5.08,2.54
1X10 = drill 1.016 pad 1.88: 1 0,0; 2 2.54,0; 3 5.08,0; 4 7.62,0; 5 10.16,0; 6 12.7,0; 7 15.24,0; 8 17.78,0; 9 20.32,0; 10 22.86,0
1X02 = drill 1.016 pad 1.88: 1 0,0; 2 2.54,0
AUDIO_JACK_3.5MM_TRRS_SMD_RA = smd 1.2 x 2.5: EARTH 11.3,-3.25; RING1 6.2,3.25; RING2 3.2,3.25; TIP 10.2,3.25 | hole 1.2: 1.6,0; 8.6,0
1X01NS = drill 1.016 pad 1.88: 1 0,0
HC49US = drill 0.813: 1 -2.413,0; 2 2.413,0
CHIPLED_0805 = smd 1.2 x 1.2: A 0,-1.05; C 0,1.05
R0603 = smd 0.889 x 0.889: 1 0,0.762; 2 0,-0.762
SOT-23 = smd 1.016 x 1.143: 1 -0.889,-1.016; 2 0.889,-1.016; 3 0,1.016
L0603 = smd 0.889 x 0.889: 1 -0.762,0; 2 0.762,0
ALPS_SKHH = drill 1.016 pad 1.88: 1 -3.251,2.261; 2 3.251,2.261; 3 -3.251,-2.261; 4 3.251,-2.261; 5 0,-4.1
SOLDERJUMPER = smd 1.168 x 1.6: 1 -0.762,0; 2 0.762,0
MICRO-SD-SOCKET-PP = smd 0.8 x 1.5: 1 -8.94,10.7; 2 -7.84,10.3; 3 -6.74,10.7; 4 -5.64,10.9; 5 -4.54,10.7; 6 -3.44,10.9; 7 -2.34,10.7; 8 -1.24,10.7 | smd 1.8 x 1.4: CD1 -7.75,0.4; CD2 -2.05,0.4 | smd 1.4 x 1.9: GND1 -13.6,14.55; GND2 -0.45,13.55
SOT23-5 = smd 0.55 x 1.2: 1 -0.95,-1.3; 2 0,-1.3; 3 0.95,-1.3; 4 0.95,1.3; 5 -0.95,1.3
QFN32 = smd 0.305 x 0.813: 1 1.75,2.4; 2 1.25,2.4; 3 0.75,2.4; 4 0.25,2.4; 5 -0.25,2.4; 6 -0.75,2.4; 7 -1.25,2.4; 8 -1.75,2.4; 17 -1.75,-2.4; 18 -1.25,-2.4; 19 -0.75,-2.4; 20 -0.25,-2.4; 21 0.25,-2.4; 22 0.75,-2.4; 23 1.25,-2.4; 24 1.75,-2.4 | smd 0.813 x 0.305: 9 -2.4,1.75; 10 -2.4,1.25; 11 -2.4,0.75; 12 -2.4,0.25; 13 -2.4,-0.25; 14 -2.4,-0.75; 15 -2.4,-1.25; 16 -2.4,-1.75; 25 2.4,-1.75; 26 2.4,-1.25; 27 2.4,-0.75; 28 2.4,-0.25; 29 2.4,0.25; 30 2.4,0.75; 31 2.4,1.25; 32 2.4,1.75 | smd 3.607 x 3.607: HTAB 0,0
DBV5 = smd 1.473 x 0.559: 1 -1.118,0.95; 2 -1.118,0; 3 -1.118,-0.95; 4 1.118,-0.95; 5 1.118,0.95
LQFP32-08 = smd 1.3 x 0.4: 1 -4.493,2.8; 2 -4.493,2; 3 -4.493,1.2; 4 -4.493,0.4; 5 -4.493,-0.4; 6 -4.493,-1.2; 7 -4.493,-2; 8 -4.493,-2.8; 17 4.493,-2.8; 18 4.493,-2; 19 4.493,-1.2; 20 4.493,-0.4; 21 4.493,0.4; 22 4.493,1.2; 23 4.493,2; 24 4.493,2.8 | smd 0.4 x 1.3: 9 -2.8,-4.493; 10 -2,-4.493; 11 -1.2,-4.493; 12 -0.4,-4.493; 13 0.4,-4.493; 14 1.2,-4.493; 15 2,-4.493; 16 2.8,-4.493; 25 2.8,4.493; 26 2,4.493; 27 1.2,4.493; 28 0.4,4.493; 29 -0.4,4.493; 30 -1.2,4.493; 31 -2,4.493; 32 -2.8,4.493
LQFP64-05 = smd 1.2 x 0.25: 1 -5.915,3.759; 2 -5.915,3.251; 3 -5.915,2.743; 4 -5.915,2.261; 5 -5.915,1.753; 6 -5.915,1.245; 7 -5.915,0.762; 8 -5.915,0.254; 9 -5.915,-0.254; 10 -5.915,-0.762; 11 -5.915,-1.245; 12 -5.915,-1.753; 13 -5.915,-2.261; 14 -5.915,-2.743; 15 -5.915,-3.251; 16 -5.915,-3.759; 33 5.915,-3.759; 34 5.915,-3.251; 35 5.915,-2.743; 36 5.915,-2.261; 37 5.915,-1.753; 38 5.915,-1.245; 39 5.915,-0.762; 40 5.915,-0.254; 41 5.915,0.254; 42 5.915,0.762; 43 5.915,1.245; 44 5.915,1.753; 45 5.915,2.261; 46 5.915,2.743; 47 5.915,3.251; 48 5.915,3.759 | smd 0.25 x 1.2: 17 -3.759,-5.915; 18 -3.251,-5.915; 19 -2.743,-5.915; 20 -2.261,-5.915; 21 -1.753,-5.915; 22 -1.245,-5.915; 23 -0.762,-5.915; 24 -0.254,-5.915; 25 0.254,-5.915; 26 0.762,-5.915; 27 1.245,-5.915; 28 1.753,-5.915; 29 2.261,-5.915; 30 2.743,-5.915; 31 3.251,-5.915; 32 3.759,-5.915; 49 3.759,5.915; 50 3.251,5.915; 51 2.743,5.915; 52 2.261,5.915; 53 1.753,5.915; 54 1.245,5.915; 55 0.762,5.915; 56 0.254,5.915; 57 -0.254,5.915; 58 -0.762,5.915; 59 -1.245,5.915; 60 -1.753,5.915; 61 -2.261,5.915; 62 -2.743,5.915; 63 -3.251,5.915; 64 -3.759,5.915
RN41 = smd 0.8 x 1.6: 1 -6.6,-6.6; 2 -5.4,-6.6; 3 -4.2,-6.6; 4 -3,-6.6; 5 -1.8,-6.6; 6 -0.6,-6.6; 7 0.6,-6.6; 8 1.8,-6.6; 9 3,-6.6; 10 4.2,-6.6; 11 5.4,-6.6; 12 6.6,-6.6; 13 6.6,6.6; 14 5.4,6.6; 15 4.2,6.6; 16 3,6.6; 17 1.8,6.6; 18 0.6,6.6; 19 -0.6,6.6; 20 -1.8,6.6; 21 -3,6.6; 22 -4.2,6.6; 23 -5.4,6.6; 24 -6.6,6.6 | smd 1.6 x 0.8: 25 -9.4,4.8; 26 -9.4,3.2; 27 -9.4,1.6; 28 9.4,3.1; 29 9.4,-3.1; 30 9.4,-4.122; 31 9.4,-1.9; 32 9.4,-0.7; 33 9.4,0.7; 34 9.4,1.9; 35 9.4,4.122
SOT-223 = smd 1.27 x 2.286: 1 -2.286,-3.175; 2 0,-3.175; 3 2.286,-3.175 | smd 3.556 x 2.159: PAD 0,3.175
MOUNTINGHOLE_2.5_PLATED = drill 2.5 pad 3.2: P$1 0,0

### Placement (x,y rotation side)
C1  27.94,36.44 180 top
C2  29.46,36.44 180 top
C3  24.13,14.34 90 top
C4  24.13,11.55 90 top
C5  31.5,25.27 0 top
C6  27.94,23.74 180 top
C7  29.72,26.03 0 top
C8  26.29,15.11 0 top
C9  35.31,27.55 90 top
C10  44.12,29.61 180 top
C11  43.89,32.86 0 top
C12  28.45,6.22 90 top
C13  54.86,19.68 0 top
C14  56.9,19.68 0 top
C15  28.45,2.66 90 top
C16  -38.35,-66.68 0 top  (outside the outline)
C17  12.19,16.63 270 top
C18  12.19,14.09 270 top
C19  37.72,41.9 180 top
C20  45.47,37.08 0 top
C21  35.05,4.18 270 top
C22  35.05,6.22 90 top
CN1  53.09,40.76 0 top
FID2  -9.91,-141.61 0 top  (outside the outline)
FID3  -6.35,-141.61 0 top  (outside the outline)
J1  1.27,14.09 90 top
J2  31.62,42.28 270 top
J3  8.89,11.55 90 top
J4  57.15,11.55 90 top
J5  62.23,14.09 90 top
J6  31.75,6.47 270 top
J7  10.92,42.03 270 top
JP1  1.27,26.79 90 top
JP2  -30.99,-239.15 0 top  (outside the outline)
K1  19.81,13.58 270 top
LED1  46.86,20.57 270 top
LED2  23.11,42.92 90 top
LED3  23.11,41.01 90 top
LED4  40.64,42.92 90 top
LED5  40.64,41.01 270 top
R1  46.86,22.22 90 top
R2  19.56,42.41 0 top
R3  18.03,42.41 0 top
R4  4.83,27.55 270 top
R5  29.84,33.14 270 top
R6  24,2.66 270 top
R7  30.99,36.44 0 top
R8  32.51,36.44 0 top
R9  24,1.14 270 top
R10  27.94,26.79 270 top
R11  32.26,27.55 270 top
R12  35.31,26.03 0 top
R13  28.45,4.44 270 top
R14  45.34,25.52 180 top
R15  45.47,42.28 180 top
R16  38.86,35.04 270 top
R17  43.94,42.28 180 top
R18  43.05,36.95 180 top
R19  49.91,25.52 180 top
R20  46.86,25.52 90 top
R21  48.39,25.52 180 top
S1  8.18,23.23 180 top
SJ1  46.86,16.12 180 top
SJ2  46.86,18.53 180 top
SJ3  34.67,36.19 270 top
U1  37.47,18.41 0 bottom
U2  38.73,37.58 90 top
U3  47.75,9.26 90 top
U4  38.61,8.76 270 top
U5  21.59,28.82 180 top
U6  36.83,18.15 270 top
U7  -23.88,-149.74 0 top  (outside the outline)
U8  49.78,30.78 270 top
U$1  -22.86,-87.51 0 top  (outside the outline)
U$3  -22.86,-211.97 0 top  (outside the outline)
U$15  -22.86,-122.82 0 top  (outside the outline)

### Tracks (layer width: path | path; a pad name or v marks a point on that pad's centre or on a via)
0/RX1
  Top 0.254: R6.1 24.77,6.34 27.18,8.76 34.53,8.76 36.07,10.29 U6.39
1/TX1
  Top 0.254: R9.1 25.91,1.14 26.16,1.39 26.16,6.98 27.43,8.25 34.6,8.25 36.58,10.23 U6.40
3.3V  (via drill 0.35)  (13 unrouted)
  Top 0.254: U3.20 51.3,9.01 53.09,7.23 v53.09,6.72 55.18,6.72 62.23,10.79 J5.1 | U6.48 40.59,11.48 41.03,11.04 v41.61,11.04 | R12.2 37.08,26.03 37.59,25.52 U6.7
  Top 0.406: R19.2 R21.2 R20.2 R14.2 44.7,26.28 44.2,26.79 44.2,28.52 C10.1 | U8.3 44.22,28.49 C10.1 | C10.1 37.82,28.59 35.81,30.6 v35.31,30.6
7/SPI_MOSI  (2 unrouted)
9  (via drill 0.35)
  Top 0.254: U3.24 51.28,11.01 51.56,11.3 v51.56,12.06 | v42.42,9.52 42.29,9.52 41.99,9.83 40.96,9.83 39.63,11.15 39.63,12.19 U6.46
  Bottom 0.254: v42.42,9.52 42.43,9.52 43.14,10.23 43.73,10.23 43.93,10.03 | 43.93,10.03 43.94,10.03 | 43.93,10.03 44.14,9.81 44.14,8.3 45.72,6.72 50.04,6.72 51.56,8.25 v51.56,12.06
10/SPI_CS  (via drill 0.35)  (2 unrouted)
  Top 0.254: R14.1 44.45,24.76 42.93,26.28 v40.64,26.28
11  (via drill 0.35)  (1 unrouted)
  Top 0.254: U3.21 51.88,9.51 v52.33,9.06
12/SPI_MISO  (2 unrouted)
13/LED  (2 unrouted)
14/SPI_SCK  (2 unrouted)
15/A1  (1 unrouted)
18/A4/SDA  (via drill 0.35)  (3 unrouted)
  Top 0.254: U6.38 35.59,10.81 v34.8,10.03
19/A5/SCL  (via drill 0.35)  (3 unrouted)
  Top 0.254: U6.37 35.08,11.32 v33.27,9.52
20/A6/SPI_CS  (1 unrouted)
21/A7/SPI_CS  (1 unrouted)
22/A8  (1 unrouted)
23/A9  (via drill 0.35)  (1 unrouted)
  Top 0.254: U3.23 51.8,10.51 52.32,11.04 v52.32,12.82
AGND  (1 unrouted)
  Top 0.254: C6.2 27.94,25.01 | 27.94,25.01 R10.2 | 27.94,25.01 C7.2 30.99,25.01 C5.2 32.51,24.5 32.77,24.76 33.02,24.76 | U6.15 33.58,24.71 33.53,24.76 33.02,24.76 | U6.16 33.07,24.71 33.02,24.76
D3
  Top 0.254: R2.2 20.83,42.92 LED2.C
D4
  Top 0.254: LED3.C 20.83,41.01 20.07,40.25 18.29,40.25 18.03,40.51 R3.2
D+  (1 unrouted)
  Top 0.254: J2.D+ 31.62,37.84 31.11,37.33
D-  (1 unrouted)
  Top 0.254: J2.D- 32.27,37.44
GND  (via drill 0.35)  (38 unrouted)
  Top 0.254: v42.14,12.01 42.35,11.8 42.99,11.8 43.6,11.19 44.13,11.19 44.3,11.01 U3.1 | J6.1 29.72,6.47 | U3.3 44.01,10.01 43.75,10.28 42.18,10.28 41.14,10.28 40.08,11.34 U6.47 | C9.2 36.32,27.55 v37.08,26.79 | S1.3 S1.4 5.59,26.15 R4.1
  Top 0.406: U8.2 44.27,30.78 C10.2 43.89,30.85 C11.2 | LED4.C 37.97,42.92 C19.2 35.69,42.66 J2.SHIELD1 J2.SHIELD3 | U8.PAD 58.6,30.78 J5.9 | J2.GND 29.97,39.21 29.97,39.2 | J2.SHIELD2 27.94,40.51 29.24,39.2 29.97,39.2 | 29.97,39.2 30.09,39.2 30.17,39.29 | CN1.1 50.29,35.27 v50.29,34.92 48.89,36.31 C20.2
  Bottom 0.254: 38,31.87 U1.GND2 37.08,31.13 v37.08,26.79 | J6.1 29.21,9.01 v22.86,9.01 | J1.3 3.3,21.2 3.3,23.87 S1.4
  Bottom 0.406: U1.GND1 60.78,32.96 J5.9 | U1.GND2 40.89,31.96 | 40.89,31.96 50.06,31.96 U1.GND1 | U1.6 40.91,31.95 40.89,31.96 | v50.29,34.92 51.06,34.14 U1.GND1
  pour Bottom: 17.02,17.14 25.15,17.14 25.15,8.5 24.13,7.49 17.78,7.49 17.02,8.25
  pour Top: 25.15,9.26 30.48,9.26 30.48,14.85 25.65,14.85 25.15,15.36 25.15,18.41 24.13,19.42 17.53,19.42 17.02,18.92 17.02,8.25 17.78,7.49 24.13,7.49 25.15,8.5
HPGND  (via drill 0.35)  (2 unrouted)
  Top 0.254: U3.4 v43.44,9.51 v43.43,9.52
  Bottom 0.254: J4.2 54.61,9.57 53.34,8.3 52.44,8.3 51.51,7.37 51.51,6.68 50.95,6.11 43.94,6.11 43.58,6.47 43.58,9.37 v43.43,9.52
HPL  (2 unrouted)
HPR  (via drill 0.35)  (1 unrouted)
  Top 0.254: U3.2 44.16,10.51 43.94,10.73 43.06,10.73 43.06,10.74 42.98,10.74 v42.67,11.04
  Bottom 0.254: J4.1 57.15,11.48 53.56,7.89 52.6,7.89 51.92,7.21 51.92,6.32 51.31,5.71 43.67,5.71 43.18,6.2 43.18,7.76 41.72,9.22 41.72,9.81 42.13,10.23 42.42,10.23 42.67,10.48 v42.67,11.04
ID  (via drill 0.35)  (1 unrouted)
  Top 0.254: U6.23 29.26,18.92 29.16,18.82 27.53,18.82 24.89,21.46 v24.64,21.46 | J2.ID 30.97,38.46 30.61,38.09 v27.05,38.09 23.59,34.63 23.59,33.39
  Bottom 0.254: v24.64,21.46 24.64,35.68 v27.05,38.09
LIL  (1 unrouted)
LIL_ISO  (1 unrouted)
LIR  (1 unrouted)
LIR_ISO  (1 unrouted)
LOL  (1 unrouted)
LOL_ISO  (1 unrouted)
LOR  (1 unrouted)
LOR_ISO  (1 unrouted)
MIC
  Top 0.254: R13.1 29.21,3.93 29.46,3.68 C15.2 31.24,2.66 31.75,3.17 J6.2
MIC_BIAS
  Top 0.254: C12.1 27.69,5.96 R13.2 26.89,3.64 26.88,3.64 26.57,3.32 26.57,1.07 27.18,0.46 44.33,0.46 44.36,0.48 49.43,3.4 49.5,3.48 U3.16
N$1  (via drill 0.35)
  Top 0.406: CN1.2 54.09,39.25 53.09,40.25 51.05,40.25 48.64,37.84 C20.1 44.07,37.84 R18.1 v43.94,39.24 | U2.3 40.03,39.39 v40.13,39.49
  Bottom 0.406: v40.13,39.49 41.15,40.51 43.18,40.51 43.94,39.74 v43.94,39.24
N$2  (via drill 0.35)
  Top 0.254: U6.22 29.17,19.4 29,19.22 28.14,19.22 25.15,22.22 24.13,22.22 v23.11,21.2 | v23.62,36.7 22.17,36.7 21.56,36.09 20.91,36.09 18.79,33.96 U5.16
  Bottom 0.254: v23.62,36.7 23.11,36.19 23.11,35.16 22.88,34.92 22.88,34.34 23.11,34.11 v23.11,21.2
N$3  (via drill 0.35)
  Top 0.254: U6.24 24.97,18.41 22.88,20.49 22.82,20.49 22.77,20.54 21.74,20.54 v21.08,21.2 | v19.3,31.62 U5.17
  Bottom 0.254: v21.08,21.2 21.08,29.84 v19.3,31.62
N$4  (1 unrouted)
N$5
  Top 0.254: C3.1 24.38,13.33 28.96,13.33 30.02,14.39 U6.32
  Top 0.406: K1.1 21.46,14.34 C3.1
N$6
  Top 0.254: C4.1 23.37,10.79 23.88,10.28 31.94,10.28 33.07,11.41 U6.33
  Top 0.406: K1.2 20.19,11.55 C4.1
N$7
  Top 0.254: U6.14 34.09,24.76 34.09,25.2 32.32,25.2 C5.1 R11.2
N$8  (1 unrouted)
N$9  (1 unrouted)
N$10  (via drill 0.35)
  Top 0.254: v35.56,33.9 35.56,32.73 36.65,31.64 36.65,31.13 35.85,31.13 35.62,31.36 34.99,31.36 34.55,30.91 34.55,30.29 34.99,29.84 35.82,29.84 37.6,28.06 38.39,28.06 38.58,27.87 U6.5 | v32.77,33.9 R7.2
  Bottom 0.254: v35.56,33.9 v32.77,33.9
N$11
  Top 0.254: U6.17 29.01,21.91 C6.1
N$12  (1 unrouted)
N$13  (1 unrouted)
N$14
  Top 0.254: R8.2 34.04,34.16 34.04,33.39 34.67,32.76 34.86,32.76 35.75,31.86 35.65,31.77 34.82,31.77 34.14,31.08 34.14,30.12 34.82,29.43 35.65,29.43 37.43,27.65 38.08,27.65 U6.6
N$15  (1 unrouted)
  Top 0.254: U6.13 34.57,26 R12.1 33.53,26.03 33.02,26.54 R11.1
N$18  (via drill 0.35)
  Top 0.406: SJ3.2 36.32,35.43 37.59,34.16 41.66,34.16 41.91,34.41 v41.91,34.66 | v42.67,39.24 42.16,38.73 R18.2
  Bottom 0.406: v41.91,34.66 41.91,38.47 v42.67,39.24
N$52  (1 unrouted)
N$68  (2 unrouted)
N$70  (via drill 0.35)
  Top 0.254: U6.25 24.9,17.9 22.72,20.09 22.65,20.09 22.6,20.13 20.12,20.13 v19.05,21.2 | U5.15 19.59,34.19 21.08,35.68 v22.35,35.68
  Bottom 0.254: v22.35,35.68 19.05,32.38 19.05,32.36 18.6,31.91 18.6,31.32 19.05,30.87 19.05,27.61 19.55,27.1 19.55,26.48 19.05,25.97 v19.05,21.2
N$71
  Top 0.254: LED5.C 42.67,41.01 43.18,41.52 R17.1
N$72
  Top 0.254: U2.1 40.83,36.63 41.15,36.95 41.15,39.24 41.91,40 44.46,40 45.17,39.29 45.76,39.29 46.47,40 46.48,40 46.99,40.51 46.99,42.54 46.48,43.05 R15.2 R17.2
N$73  (via drill 0.35)  (1 unrouted)
  Top 0.254: LED2.A 25.53,42.92 25.91,42.54 25.91,39.74 23.62,37.46 v22.61,37.46
  Bottom 0.254: v22.61,37.46 21.34,36.19 21.34,35.43 19.81,33.9 17.02,33.9 16.51,33.39 16.51,31.31 16,30.81
N$74  (via drill 0.35)  (1 unrouted)
  Top 0.254: LED3.A 25.15,41.01 25.5,40.66 25.5,39.91 25.08,39.49 23.62,39.49 21.03,36.9 20.58,36.9 18.8,35.12 17.49,35.12 17.07,34.7 17.07,34.12 17.53,33.66 v17.53,32.89
  Bottom 0.254: v17.53,32.89 17.53,30.35 15.59,28.41
N$75
  Top 0.254: U2.5 37.44,35.71 R16.2
N$76  (via drill 0.35)
  Top 0.254: R15.1 v45.47,40 | v47.24,43.55 46.99,43.55 46.55,43.99 42.77,43.99 LED4.A
  Bottom 0.254: v45.47,40 47.24,41.78 v47.24,43.55
N$79  (2 unrouted)
N$80
  Top 0.254: U3.15 49,3.66 48.93,3.58 44.25,0.88 28.19,0.88 27.43,1.64 C15.1
PIO4  (1 unrouted)
  Top 0.254: JP1.1 3.3,26.79 R4.2
  Bottom 0.254: JP1.1 1.27,27.55 5.72,32.01
PROG
  Top 0.254: J1.4 2.01,20.97 S1.2 S1.1 14.3,23.84 15.15,23.84 15.36,24.05 15.79,24.05 16.2,24.46 16.2,25.05 15.75,25.51 15.75,29.17 15.95,29.37 15.95,30.55 16.22,30.82 U5.18
RESET  (via drill 0.35)  (2 unrouted)
  Top 0.254: v15.49,24.76 14.99,24.25 11.98,24.25 11.96,24.22 4.4,24.22 4.38,24.25 J1.5 | v17.02,24.25 18.71,24.25 U5.25 | U6.34 33.58,11.35 v31.75,9.52
  Bottom 0.254: v15.49,24.76 16.51,24.76 v17.02,24.25
SMIRF_RX  (1 unrouted)
SMIRF_TX  (1 unrouted)
V_USB
  Top 0.406: J2.VBUS 33.25,39.24 34.29,39.24 | 34.29,39.24 34.67,38.85 SJ3.1 | 34.29,39.24 37.34,39.24 37.34,38.63 U2.4 37.44,40.86 C19.1 39.46,41.14 LED5.A
VIN  (via drill 0.35)  (2 unrouted)
  Top 0.254: C11.1 36.9,33.62 v36.62,33.9
  Top 0.406: 43.05,34.92 43.05,34.46 C11.1 44.48,33.62 45.03,33.06 U8.1 | 43.05,34.92 R18.3 | 43.05,34.92 43.31,35.17 v46.99,35.17
  Bottom 0.254: v36.62,33.9 36.62,29.06 36.07,28.51 36.07,26.28 36.32,26.03 37.85,26.03 38.1,26.28 38.1,26.79 38.35,27.04 42.67,27.04 42.93,26.79
  Bottom 0.406: J5.10 60.45,35.17 51.22,35.17 50.64,35.75 49.95,35.75 49.36,35.17 v46.99,35.17
VRTC  (1 unrouted)